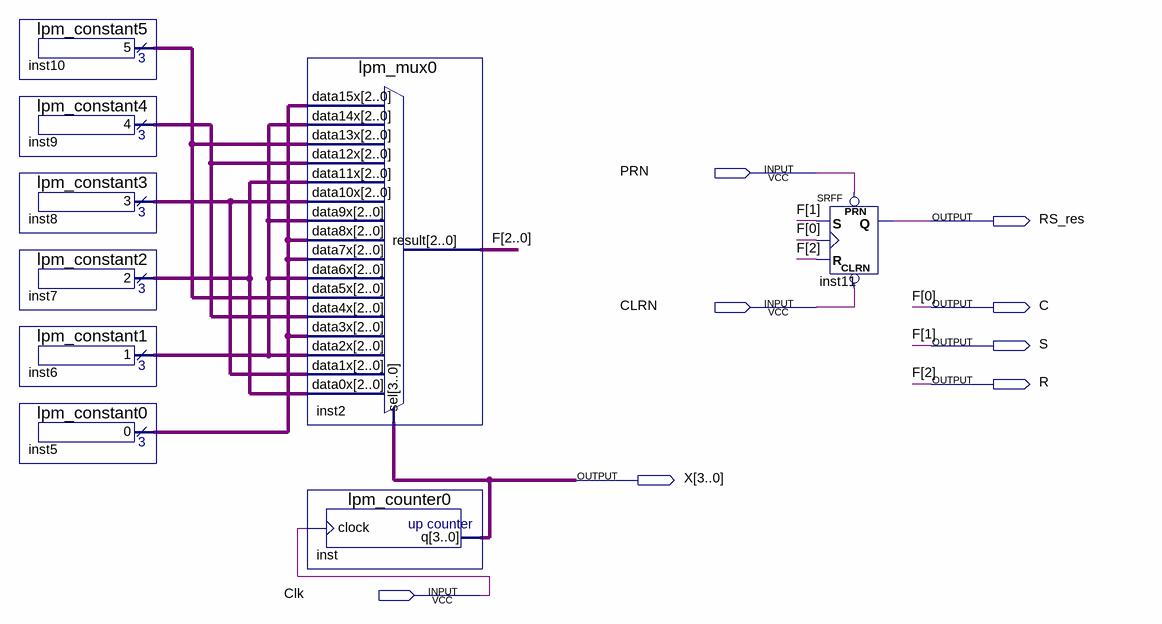
[diagram p0: schematic sheet]
// Quartus schematic lab04_RS.bdf as structural Verilog: 9 symbols, 8 pins
module lab04_RS (
  input  PRN,
  input  CLRN,
  input  Clk,
  output RS_res,
  output C,
  output S,
  output R,
  output [3:0] X
);

  wire [2:0] inst5_result, inst6_result, inst7_result, inst8_result, inst9_result, inst10_result;

  lpm_constant5 inst10 (.result(inst10_result));
  lpm_constant4 inst9 (.result(inst9_result));
  lpm_constant3 inst8 (.result(inst8_result));
  lpm_constant2 inst7 (.result(inst7_result));
  lpm_constant1 inst6 (.result(inst6_result));
  lpm_constant0 inst5 (.result(inst5_result));
  lpm_mux0 inst2 (
    .data15x(inst5_result), .data14x(inst6_result), .data13x(inst10_result), .data12x(inst9_result),
    .data11x(inst7_result), .data10x(inst8_result), .data9x(inst6_result), .data8x(inst5_result),
    .data7x(inst5_result), .data6x(inst6_result), .data5x(inst10_result), .data4x(inst9_result),
    .data3x(inst5_result), .data2x(inst6_result), .data1x(inst8_result), .data0x(inst7_result), .sel(X),
    .result({R, S, C}));
  lpm_counter0 inst (.clock(Clk), .q(X));
  SRFF inst11 (.PRN(PRN), .CLRN(CLRN), .S(S), .R(R), .CLK(C), .Q(RS_res));

  // Other names for the same wires on the sheet: F[2:0] = {R, S, C}
endmodule
